# Altium schematic sheet TRX_Protection.SchDoc: TRX Protection Circuit
size A4; Date: 07.10.2023; ApprovedBy: M.Sc. Tobias Wirth; CheckedBy: M.Sc. Tobias Wirth; Author: M.Sc. Tobias Wirth; CompanyName: University of Stuttgart; DrawnBy: M.Sc. Tobias Wirth; Engineer: M.Sc. Tobias Wirth; Organization: IIS; Address1: Pfaffenwaldring 47; Address2: 70569 Stuttgart; Revision: V1.1; SheetNumber: 14; SheetTotal: 17; ProjectNameAlt: AUS - NMR System; Time: 10:00; ImagePath: N/A; Application_BuildNumber: N/A
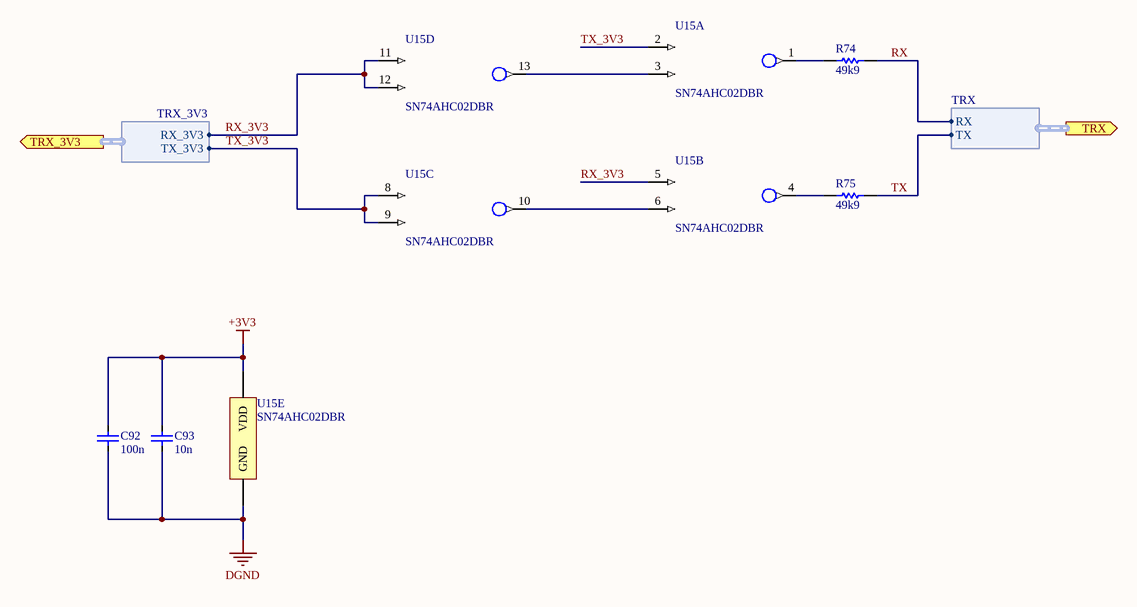
[diagram p0: TRX_Protection.SchDoc]

## Parts
C92  100n  [CAP_0402]
C93  10n  [CAP_0402]
R74  49k9  [RES_0402]
R75  49k9  [RES_0402]
U15  SN74AHC02DBR  [SOP65P780X200-14N]  (parts A,B,C,D,E of 5)

## Ports
TRX (out, harness TRX), TRX_3V3 (out, harness TRX_3V3)

## Harnesses
TRX_3V3: TX_3V3, RX_3V3
TRX: TX, RX

## Nets
+3V3: C92.1 C93.1 U15.14(VDD)
DGND: C92.2 C93.2 U15.7(GND)
RX: R74.2 ; port TRX.RX
RX_3V3: U15.5(2A) U15.11(4A) U15.12(4B) ; port TRX_3V3.RX_3V3
TX: R75.2 ; port TRX.TX
TX_3V3: U15.2(1A) U15.8(3A) U15.9(3B) ; port TRX_3V3.TX_3V3
NetR74_1: R74.1 U15.1(1Y)
NetR75_1: R75.1 U15.4(2Y)
NetU15_3: U15.3(1B) U15.13(4Y)
NetU15_6: U15.6(2B) U15.10(3Y)

## Notes on the sheet
- Title
- Size
- Date:
- Sheet
- A4
- of
- Project
- Drawn By:
- Revision:

## Library data of the parts
C92 C93 = Cap: Supplier: *; Part Number: *
  C92: Value: 100n
  C93: Value: 10n
R74 R75 = Res: Part Number: *; Supplier: *; Value: 49k9
U15 = SNx4AHC02: Quadruple 2-Input Positive-Nor Gates; Supplier 1: Mouser; Supplier Part Number 1: 595-SN74AHC02DBR